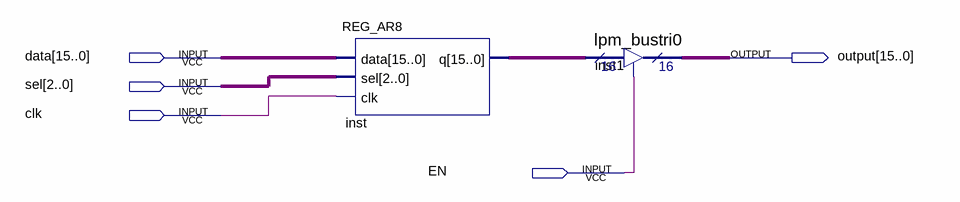
[diagram p0: schematic sheet]
// Quartus schematic REG8withlpm.bdf as structural Verilog: 2 symbols, 5 pins
module REG8withlpm (
  input  [15:0] data,
  input  [2:0] sel,
  input  clk,
  input  EN,
  output [15:0] \output 
);

  wire [15:0] inst_q;

  REG_AR8 inst (.data(data), .sel(sel), .clk(clk), .q(inst_q));
  lpm_bustri0 inst1 (.enabledt(EN), .data(inst_q), .tridata(\output ));
endmodule
